# Altium schematic sheet mcu.SchDoc
size A
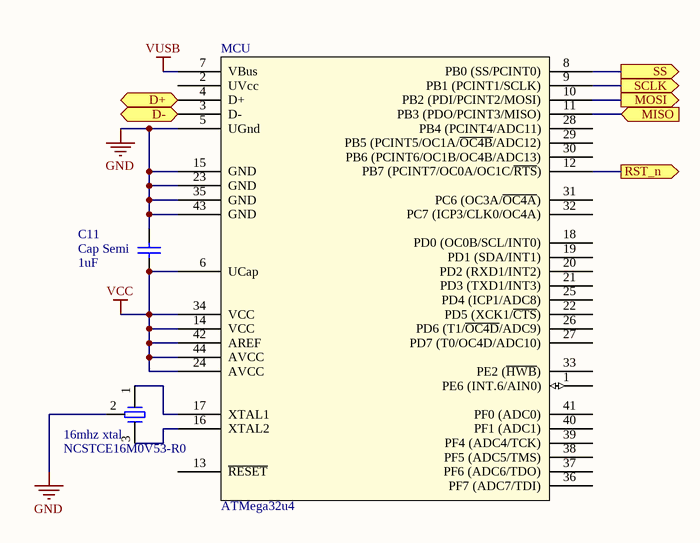
[diagram p0: mcu.SchDoc]

## Parts
16mhz_xtal  NCSTCE16M0V53-R0  [OSC]
C11  Cap Semi  value 1uF  [CAPC1608L]
MCU  ATMega32u4  [TQFP44_M]

## Ports
D+ (bidir), D- (bidir), MISO (in), MOSI (out), RST_n (out), SCLK (out), SS (out)

## Nets
GND: 16mhz_xtal.2 C11.2 MCU.5(UGnd) MCU.15(GND) MCU.23(GND) MCU.35(GND) MCU.43(GND)
VCC: C11.1 MCU.6(UCap) MCU.14(VCC) MCU.24(AVCC) MCU.34(VCC) MCU.42(AREF) MCU.44(AVCC)
VUSB: MCU.7(VBus)
D+: MCU.4(D+) ; port D+
D-: MCU.3(D-) ; port D-
MISO: MCU.11(PB3_(PDO/PCINT3/MISO)) ; port MISO
MOSI: MCU.10(PB2_(PDI/PCINT2/MOSI)) ; port MOSI
RST_n: MCU.12(PB7_(PCINT7/OC0A/OC1C/~{RTS})) ; port RST_n
SCLK: MCU.9(PB1_(PCINT1/SCLK)) ; port SCLK
SS: MCU.8(PB0_(SS/PCINT0)) ; port SS
Net16mhz_xtal_1: 16mhz_xtal.1 MCU.17(XTAL1)
Net16mhz_xtal_3: 16mhz_xtal.3 MCU.16(XTAL2)

Not connected (* = marked no-connect by the designer): MCU 1(PE6_(INT.6/AIN0)) 2(UVcc) 13(~{RESET}) 18(PD0_(OC0B/SCL/INT0)) 19(PD1_(SDA/INT1)) 20(PD2_(RXD1/INT2)) 21(PD3_(TXD1/INT3)) 22(PD5_(XCK1/~{CTS})) 25(PD4_(ICP1/ADC8)) 26(PD6_(T1/~{OC4D}/ADC9)) 27(PD7_(T0/OC4D/ADC10)) 28(PB4_(PCINT4/ADC11)) 29(PB5_(PCINT5/OC1A/~{OC4B}/ADC12)) 30(PB6_(PCINT6/OC1B/OC4B/ADC13)) 31(PC6_(OC3A/~{OC4A})) 32(PC7_(ICP3/CLK0/OC4A)) 33(PE2_(~{HWB})) 36(PF7_(ADC7/TDI)) 37(PF6_(ADC6/TDO)) 38(PF5_(ADC5/TMS)) 39(PF4_(ADC4/TCK)) 40(PF1_(ADC1)) 41(PF0_(ADC0))

## Library data of the parts
16mhz_xtal = NCSTCE16M0V53-R0: 16MHz crystal oscillator with built in load capacatenceardf
C11 = Cap Semi: Capacitor (Semiconductor SIM Model); Published: 8-Jun-2000; LatestRevisionDate: 29-May-2009; LatestRevisionNote: IPC-7351 Footprint Added.; PackageReference: C1206; Publisher: Altium Limited; PackageDescription: Chip Capacitor
MCU = ATMega32u4: usb enabled avr microcontroller